# Altium schematic sheet Macropad.SchDoc
size A4
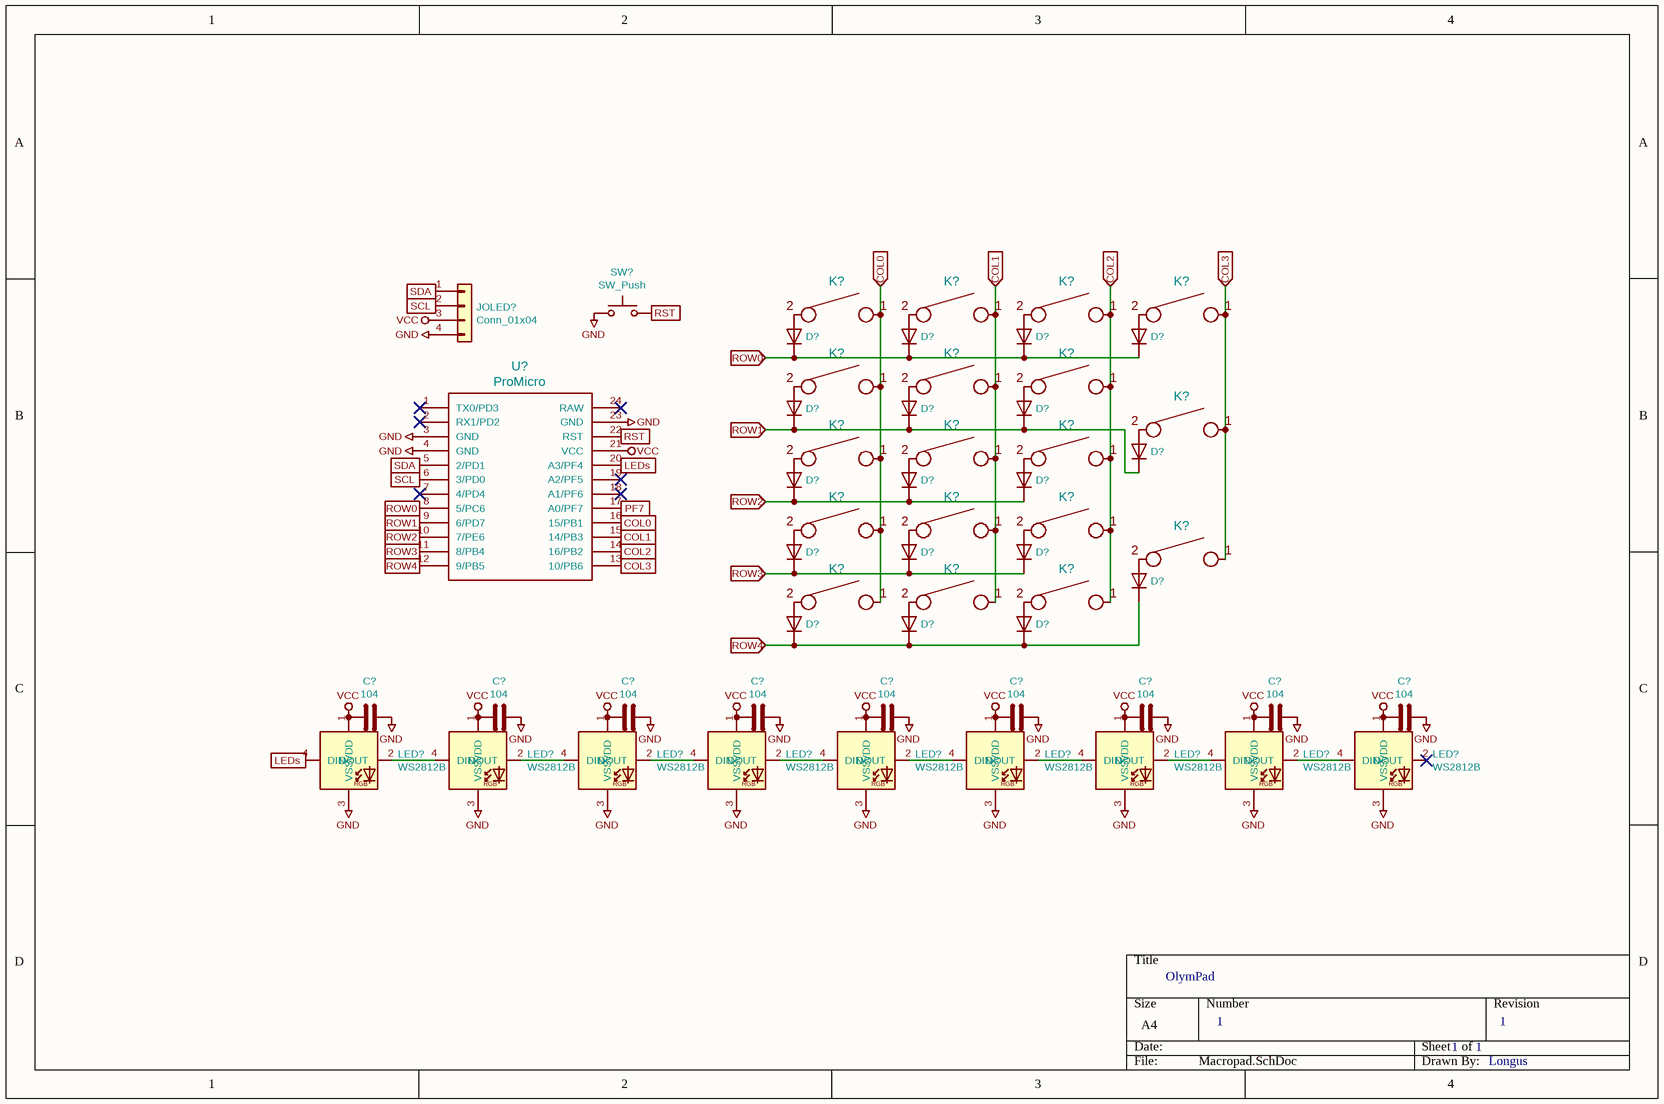
[diagram p0: Macropad.SchDoc]

## Parts
(Parts that share a designator on the sheet are numbered #1, #2 ... from top to bottom, then left to right.)
C?#1  104  [C_0805_2012Metric_Pad1.15x1.40mm_HandSolder]
C?#2  104  [C_0805_2012Metric_Pad1.15x1.40mm_HandSolder]
C?#3  104  [C_0805_2012Metric_Pad1.15x1.40mm_HandSolder]
C?#4  104  [C_0805_2012Metric_Pad1.15x1.40mm_HandSolder]
C?#5  104  [C_0805_2012Metric_Pad1.15x1.40mm_HandSolder]
C?#6  104  [C_0805_2012Metric_Pad1.15x1.40mm_HandSolder]
C?#7  104  [C_0805_2012Metric_Pad1.15x1.40mm_HandSolder]
C?#8  104  [C_0805_2012Metric_Pad1.15x1.40mm_HandSolder]
C?#9  104  [C_0805_2012Metric_Pad1.15x1.40mm_HandSolder]
D?#1  D  [D_SOD123_axial-dual]  (value not drawn)
D?#2  D  [D_SOD123_axial-dual]  (value not drawn)
D?#3  D  [D_SOD123_axial-dual]  (value not drawn)
D?#4  D  [D_SOD123_axial-dual]  (value not drawn)
D?#5  D  [D_SOD123_axial-dual]  (value not drawn)
D?#6  D  [D_SOD123_axial-dual]  (value not drawn)
D?#7  D  [D_SOD123_axial-dual]  (value not drawn)
D?#8  D  [D_SOD123_axial-dual]  (value not drawn)
D?#9  D  [D_SOD123_axial-dual]  (value not drawn)
D?#10  D  [D_SOD123_axial-dual]  (value not drawn)
D?#11  D  [D_SOD123_axial-dual]  (value not drawn)
D?#12  D  [D_SOD123_axial-dual]  (value not drawn)
D?#13  D  [D_SOD123_axial-dual]  (value not drawn)
D?#14  D  [D_SOD123_axial-dual]  (value not drawn)
D?#15  D  [D_SOD123_axial-dual]  (value not drawn)
D?#16  D  [D_SOD123_axial-dual]  (value not drawn)
D?#17  D  [D_SOD123_axial-dual]  (value not drawn)
D?#18  D  [D_SOD123_axial-dual]  (value not drawn)
JOLED?  Conn_01x04  [PinHeader_1x04_P2.54mm_Horizontal]
K?#1  KEYSW  [Kailh-PCB-Socket-1U-Cutout]  (value not drawn)
K?#2  KEYSW  [Kailh-PCB-Socket-1U-Cutout]  (value not drawn)
K?#3  KEYSW  [Kailh-PCB-Socket-1U-Cutout]  (value not drawn)
K?#4  KEYSW  [Kailh-PCB-Socket-1U-Cutout]  (value not drawn)
K?#5  KEYSW  [Kailh-PCB-Socket-1U-Cutout]  (value not drawn)
K?#6  KEYSW  [Kailh-PCB-Socket-1U-Cutout]  (value not drawn)
K?#7  KEYSW  [Kailh-PCB-Socket-1U-Cutout]  (value not drawn)
K?#8  KEYSW  [Kailh-PCB-Socket-1U-Cutout]  (value not drawn)
K?#9  KEYSW  [Kailh-PCB-Socket-1U-Cutout]  (value not drawn)
K?#10  KEYSW  [Kailh-PCB-Socket-1U-Cutout]  (value not drawn)
K?#11  KEYSW  [Kailh-PCB-Socket-1U-Cutout]  (value not drawn)
K?#12  KEYSW  [Kailh-PCB-Socket-1U-Cutout]  (value not drawn)
K?#13  KEYSW  [Kailh-PCB-Socket-1U-Cutout]  (value not drawn)
K?#14  KEYSW  [Kailh-PCB-Socket-1U-Cutout]  (value not drawn)
K?#15  KEYSW  [Kailh-PCB-Socket-1U-Cutout]  (value not drawn)
K?#16  KEYSW  [Kailh-PCB-Socket-1U-Cutout]  (value not drawn)
K?#17  KEYSW  [Kailh-PCB-Socket-1U-Cutout]  (value not drawn)
K?#18  KEYSW  [Kailh-PCB-Socket-1U-Cutout]  (value not drawn)
LED?#1  WS2812B  [LED_WS2812B_PLCC4_5.0x5.0mm_P3.2mm]
LED?#2  WS2812B  [LED_WS2812B_PLCC4_5.0x5.0mm_P3.2mm]
LED?#3  WS2812B  [LED_WS2812B_PLCC4_5.0x5.0mm_P3.2mm]
LED?#4  WS2812B  [LED_WS2812B_PLCC4_5.0x5.0mm_P3.2mm]
LED?#5  WS2812B  [LED_WS2812B_PLCC4_5.0x5.0mm_P3.2mm]
LED?#6  WS2812B  [LED_WS2812B_PLCC4_5.0x5.0mm_P3.2mm]
LED?#7  WS2812B  [LED_WS2812B_PLCC4_5.0x5.0mm_P3.2mm]
LED?#8  WS2812B  [LED_WS2812B_PLCC4_5.0x5.0mm_P3.2mm]
LED?#9  WS2812B  [LED_WS2812B_PLCC4_5.0x5.0mm_P3.2mm]
SW?  SW_Push  [SW_PUSH_6mm]
U?  ProMicro  [ArduinoProMicro]

## Ports
COL0 (in), COL1 (in), COL2 (in), COL3 (in), LEDs (in), PF7 (in), ROW0 (in), ROW1 (in), ROW2 (in), ROW3 (in), ROW4 (in), RST (in), SCL (in), SDA (in)

## Nets
GND: C?#1.1 C?#2.1 C?#3.1 C?#4.1 C?#5.1 C?#6.1 C?#7.1 C?#8.1 C?#9.1 JOLED?.4(Pin_4) LED?#1.3(VSS) LED?#2.3(VSS) LED?#3.3(VSS) LED?#4.3(VSS) LED?#5.3(VSS) LED?#6.3(VSS) LED?#7.3(VSS) LED?#8.3(VSS) LED?#9.3(VSS) SW?.1 U?.3(GND) U?.4(GND) U?.23(GND)
VCC: C?#1.2 C?#2.2 C?#3.2 C?#4.2 C?#5.2 C?#6.2 C?#7.2 C?#8.2 C?#9.2 JOLED?.3(Pin_3) LED?#1.1(VDD) LED?#2.1(VDD) LED?#3.1(VDD) LED?#4.1(VDD) LED?#5.1(VDD) LED?#6.1(VDD) LED?#7.1(VDD) LED?#8.1(VDD) LED?#9.1(VDD) U?.21(VCC)
COL0: K?#1.1 K?#5.1 K?#9.1 K?#12.1 K?#16.1 U?.16(15/PB1) ; port COL0
COL1: K?#2.1 K?#6.1 K?#10.1 K?#13.1 K?#17.1 U?.15(14/PB3) ; port COL1
COL2: K?#3.1 K?#7.1 K?#11.1 K?#14.1 K?#18.1 U?.14(16/PB2) ; port COL2
COL3: K?#4.1 K?#8.1 K?#15.1 U?.13(10/PB6) ; port COL3
LEDs: LED?#1.4(DIN) U?.20(A3/PF4) ; port LEDs
PF7: U?.17(A0/PF7) ; port PF7
ROW0: D?#1.1(K) D?#2.1(K) D?#3.1(K) D?#4.1(K) U?.8(5/PC6) ; port ROW0
ROW1: D?#5.1(K) D?#6.1(K) D?#7.1(K) D?#8.1(K) U?.9(6/PD7) ; port ROW1
ROW2: D?#9.1(K) D?#10.1(K) D?#11.1(K) U?.10(7/PE6) ; port ROW2
ROW3: D?#12.1(K) D?#13.1(K) D?#14.1(K) U?.11(8/PB4) ; port ROW3
ROW4: D?#15.1(K) D?#16.1(K) D?#17.1(K) D?#18.1(K) U?.12(9/PB5) ; port ROW4
RST: SW?.2 U?.22(RST) ; port RST
SCL: JOLED?.2(Pin_2) U?.6(3/PD0) ; port SCL
SDA: JOLED?.1(Pin_1) U?.5(2/PD1) ; port SDA
NetD?#1_2: D?#1.2(A) K?#1.2
NetD?#2_2: D?#2.2(A) K?#2.2
NetD?#3_2: D?#3.2(A) K?#3.2
NetD?#4_2: D?#4.2(A) K?#4.2
NetD?#5_2: D?#5.2(A) K?#5.2
NetD?#6_2: D?#6.2(A) K?#6.2
NetD?#7_2: D?#7.2(A) K?#7.2
NetD?#8_2: D?#8.2(A) K?#8.2
NetD?#9_2: D?#9.2(A) K?#9.2
NetD?#10_2: D?#10.2(A) K?#10.2
NetD?#11_2: D?#11.2(A) K?#11.2
NetD?#12_2: D?#12.2(A) K?#12.2
NetD?#13_2: D?#13.2(A) K?#13.2
NetD?#14_2: D?#14.2(A) K?#14.2
NetD?#15_2: D?#15.2(A) K?#15.2
NetD?#16_2: D?#16.2(A) K?#16.2
NetD?#17_2: D?#17.2(A) K?#17.2
NetD?#18_2: D?#18.2(A) K?#18.2
NetLED?#1_2: LED?#1.2(DOUT) LED?#2.4(DIN)
NetLED?#2_2: LED?#2.2(DOUT) LED?#3.4(DIN)
NetLED?#3_2: LED?#3.2(DOUT) LED?#4.4(DIN)
NetLED?#4_2: LED?#4.2(DOUT) LED?#5.4(DIN)
NetLED?#5_2: LED?#5.2(DOUT) LED?#6.4(DIN)
NetLED?#6_2: LED?#6.2(DOUT) LED?#7.4(DIN)
NetLED?#7_2: LED?#7.2(DOUT) LED?#8.4(DIN)
NetLED?#8_2: LED?#8.2(DOUT) LED?#9.4(DIN)

Not connected (* = marked no-connect by the designer): LED?#9 2(DOUT)*; U? 1(TX0/PD3)* 2(RX1/PD2)* 7(4/PD4)* 18(A1/PF6)* 19(A2/PF5)* 24(RAW)*

## Notes on the sheet
- OlymPad
- 1
- 1     1
- Longus
- (in symbol WS2812B) RGB

## Library data of the parts
C?#1-C?#9 = C: Value: 104; Footprint: Capacitor_SMD:C_0805_2012Metric_Pad1.15x1.40mm_HandSolder
K?#1-K?#18 = KEYSW-canadian_parts: Value: KEYSW; Footprint: kailh-pcb-sockets:Kailh-PCB-Socket-1U-Cutout
U? = ProMicro-keebio: Value: ProMicro; Footprint: Keebio-Parts:ArduinoProMicro
D?#1-D?#18 = D: Value: D; Footprint: canadian_footprints:D_SOD123_axial-dual
JOLED? = Conn_01x04: Value: Conn_01x04; Footprint: Connector_PinHeader_2.54mm:PinHeader_1x04_P2.54mm_Horizontal
LED?#1-LED?#9 = WS2812B: Value: WS2812B; Footprint: LED_SMD:LED_WS2812B_PLCC4_5.0x5.0mm_P3.2mm
SW? = SW_Push: Value: SW_Push; Footprint: Button_Switch_THT:SW_PUSH_6mm